# EAGLE design BalancingRobotFullSizePCB (EAGLE 6.6.0)
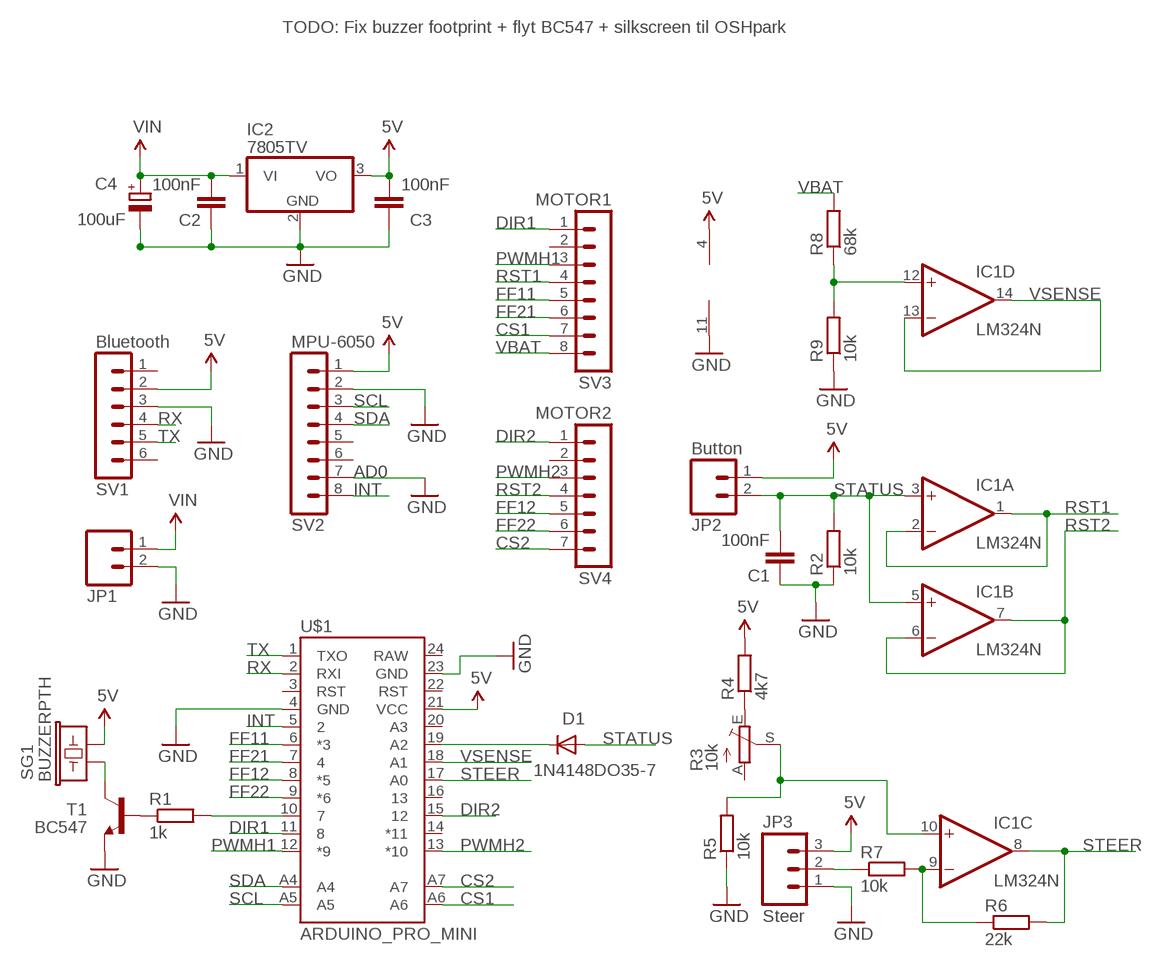
[diagram p0: schematic, sheet 1]

## Parts
C1  100nF  C-EU025-025X050  [C025-025X050]
C2  100nF  C-EU025-025X050  [C025-025X050]
C3  100nF  C-EU025-025X050  [C025-025X050]
C4  100uF  CPOL-EUE2.5-5  [E2,5-5]
D1  1N4148DO35-7  [DO35-7]
IC1  LM324N  [DIL14]
IC2  7805TV  [TO220V]
JP1  M02PTH  [1X02]
JP2  Button  M02PTH  [1X02]
JP3  Steer  M03PTH  [1X03]
R1  1k  R-EU_0207/10  [0207/10]
R2  10k  R-EU_0207/10  [0207/10]
R3  10k  TRIM_EU-B25P  [B25P]
R4  4k7  R-EU_0207/10  [0207/10]
R5  10k  R-EU_0207/10  [0207/10]
R6  22k  R-EU_0207/10  [0207/10]
R7  10k  R-EU_0207/10  [0207/10]
R8  68k  R-EU_0207/10  [0207/10]
R9  10k  R-EU_0207/10  [0207/10]
SG1  BUZZERPTH  [BUZZER-12MM]
SV1  Bluetooth  MA06-1  [MA06-1]
SV2  MPU-6050  MA08-1  [MA08-1]
SV3  MOTOR1  MA08-1  [MA08-1]
SV4  MOTOR2  MA07-1  [MA07-1]
T1  BC547  [TO92]
U$1  ARDUINO_PRO_MINI  [ARDUINO_PRO_MINI]

## Nets
5V: C3.2 IC1.4(P:V+) IC2.3(VO) JP2.1 JP3.3 R4.2 SG1.- SV1.2 SV2.1 U$1.21(VCC)
CS1: SV3.7 U$1.A6
CS2: SV4.7 U$1.A7
DIR1: SV3.1 U$1.11
DIR2: SV4.1 U$1.15
FF11: SV3.5 U$1.6(*3)
FF12: SV4.5 U$1.8(*5)
FF21: SV3.6 U$1.7
FF22: SV4.6 U$1.9(*6)
GND: C1.1 C2.1 C3.1 C4.- IC1.11(P:V-) IC2.2(GND) JP1.2 JP3.1 R2.1 R5.1 R9.1 SV1.3 SV2.2 SV2.7 T1.1(E) U$1.4(GND) U$1.23(GND)
INT: SV2.8 U$1.5
N$1: IC1.12(D:+IN) R8.1 R9.2
N$2: D1.C U$1.19(A2)
N$3: R1.1 T1.2(B)
N$4: SG1.+ T1.3(C)
N$5: R1.2 U$1.10
N$6: R3.E R4.1
N$7: IC1.10(C:+IN) R3.S R5.2
N$8: IC1.9(C:-IN) R6.1 R7.2
N$9: JP3.2 R7.1
PWMH1: SV3.3 U$1.12(*9)
PWMH2: SV4.3 U$1.13(*10)
RST1: IC1.1(A:OUT) IC1.2(A:-IN) SV3.4
RST2: IC1.6(B:-IN) IC1.7(B:OUT) SV4.4
RX: SV1.4 U$1.2(RXI)
SCL: SV2.3 U$1.A5
SDA: SV2.4 U$1.A4
STATUS: C1.2 D1.A IC1.3(A:+IN) IC1.5(B:+IN) JP2.2 R2.2
STEER: IC1.8(C:OUT) R6.2 U$1.17(A0)
TX: SV1.5 U$1.1(TXO)
VBAT: R8.2 SV3.8
VIN: C2.2 C4.+ IC2.1(VI) JP1.1
VSENSE: IC1.13(D:-IN) IC1.14(D:OUT) U$1.18(A1)
Unconnected: R3.A SV1.1 SV1.6 SV2.5 SV2.6 SV3.2 SV4.2 U$1.3(RST) U$1.14(*11) U$1.16 U$1.20(A3) U$1.22(RST) U$1.24(RAW)

## Notes on the sheet
- TODO: Fix buzzer footprint + flyt BC547 + silkscreen til OSHpark
- AD0

## Library data of the parts
C1-C3 = rcl:C-EU: CAPACITOR, European symbol
C4 = rcl:CPOL-EU: POLARIZED CAPACITOR, European symbol
D1 = diode:1N4148: DIODE high speed (Philips)
IC1 = linear:LM324: OP AMP
IC2 = linear:78*: Positive VOLTAGE REGULATOR Source: http://cache.national.com/ds/LM/LM78L05.pdf http://www.fairchildsemi.com/ds/LM/LM7805.pdf
JP1 JP2 = SparkFun-Connectors:M02: Standard 2-pin 0.1" header. Use with - straight break away headers ( PRT-00116) - right angle break away headers (PRT-00553) - swiss pins (PRT-00743) - machine pins (PRT-00117) - female headers (PRT-00115) Molex polarized connector foot print use with: PRT-08233 with associated crimp pins and housings. 2.54_SCREWTERM for use with PRT-10571. 3.5mm Screw Terminal footprints for PRT-08084 5mm Screw Terminal footprints for use with PRT-08433
JP3 = SparkFun-Connectors:M03: Header 3 Standard 3-pin 0.1" header. Use with straight break away headers (SKU : PRT-00116), right angle break away headers (PRT-00553), swiss pins (PRT-00743), machine pins (PRT-00117), and female headers (PRT-00115). Molex polarized connector foot print use with SKU : PRT-08232 with associated crimp pins and housings.
R1 R2 R4-R9 = rcl:R-EU_: RESISTOR, European symbol
R3 = pot:TRIM_EU-: POTENTIOMETER
SG1 = SparkFun-Electromechanical:BUZZER: Buzzer 12mm Spark Fun Electronics SKU : Comp-Buzzer
SV1 = con-lstb:MA06-1: PIN HEADER; OC_FARNELL: unknown; OC_NEWARK: unknown
SV2 SV3 = con-lstb:MA08-1: PIN HEADER; OC_FARNELL: unknown; OC_NEWARK: unknown
SV4 = con-lstb:MA07-1: PIN HEADER; OC_FARNELL: unknown; OC_NEWARK: unknown
T1 = transistor:BC547: NPN TRANSISTOR
U$1 = SparkFun-Boards:ARDUINO_PRO_MINI

## Board
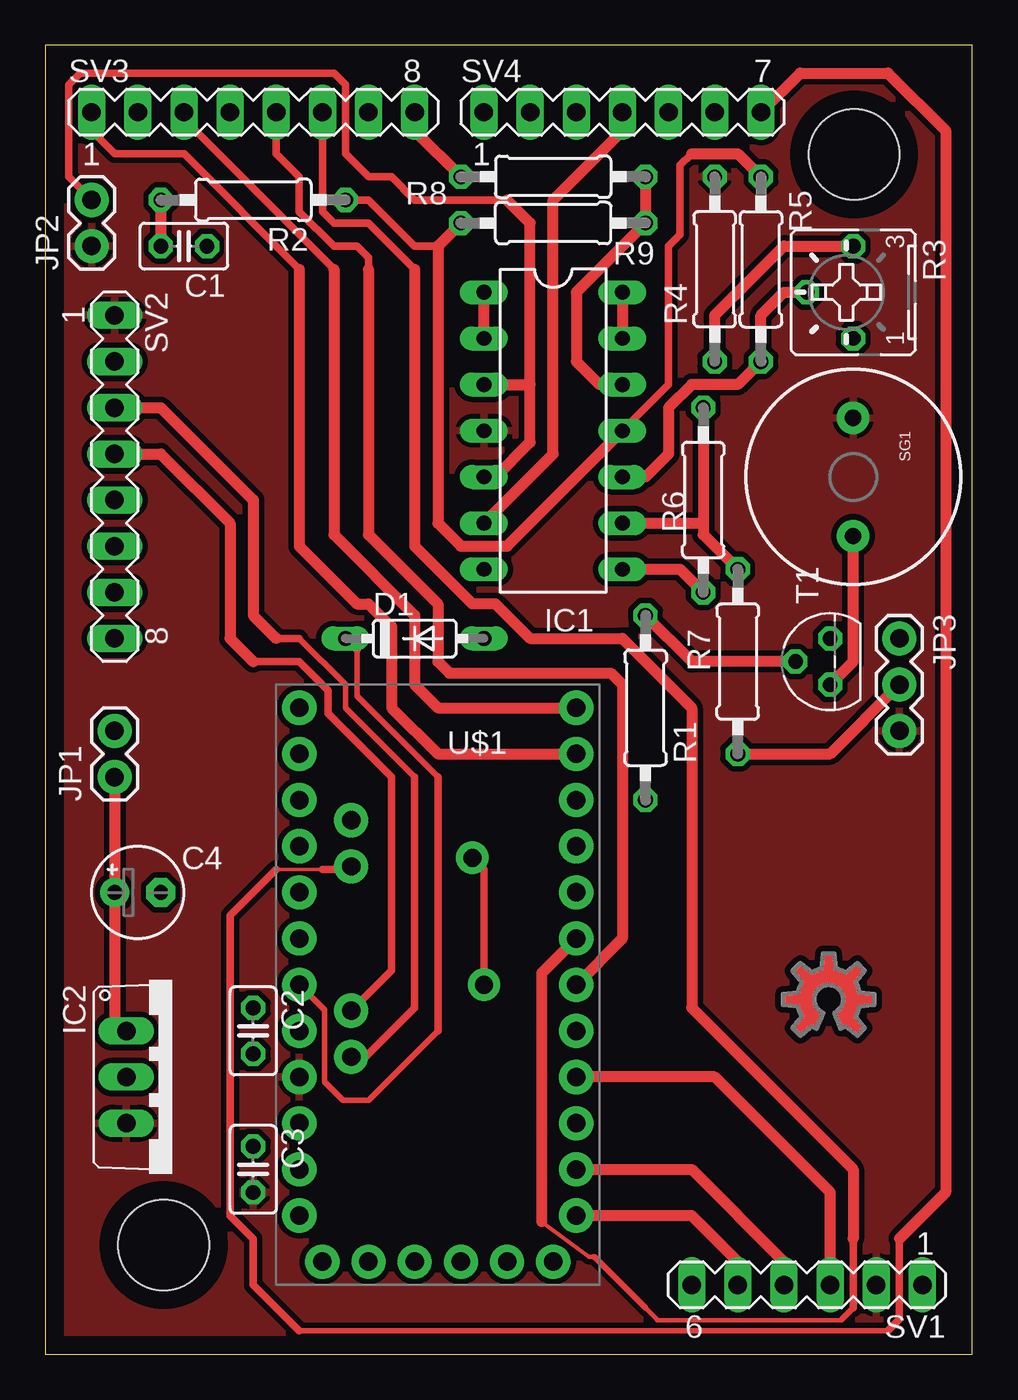
[diagram p1: board, top side]
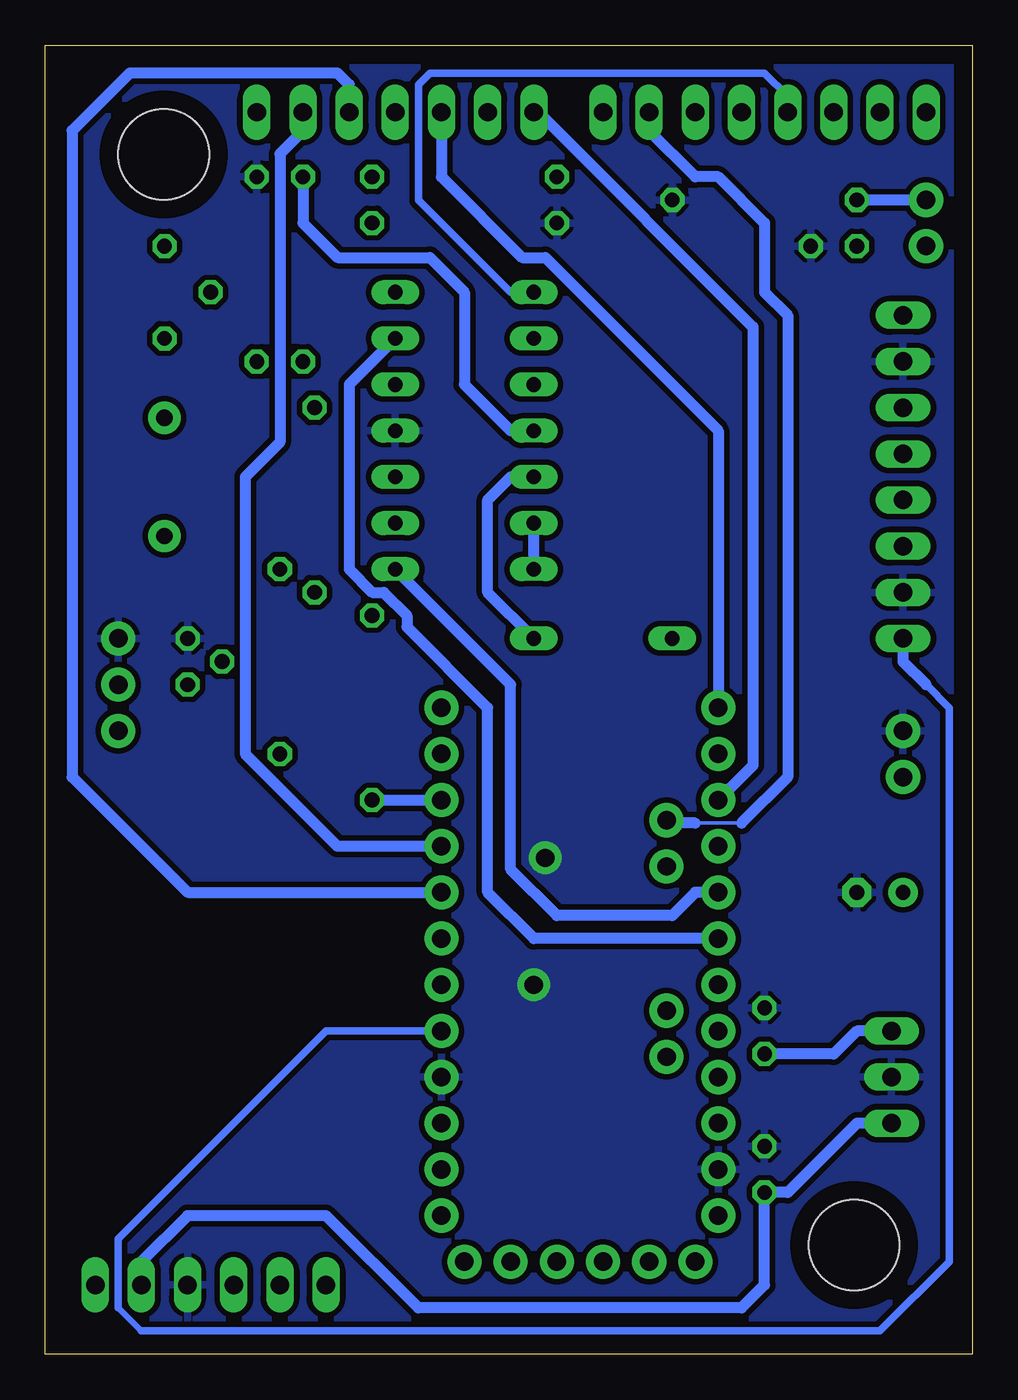
[diagram p2: board, bottom side, seen from below]

Size 51 x 72 mm. Coordinates in mm from the lower left corner, seen from the top.
Outline: 0,0 51,0 51,72 0,72 0,0
Copper layers (1*16): Top 0.035mm / dielectric 1.5mm / Bottom 0.035mm
Design rules "Design_rules": minimum track width 0.2mm, minimum drill 0.8mm, track to track 12mil, track to pad 12mil, pad to pad 12mil, via to via 12mil, smd to smd 12mil, copper to edge 40mil, drill to drill 8mil, minimum pad ring 10mil, minimum via ring 8mil, stop-mask expansion 4mil, vias tented up to drill 0mil, thermal gap 10mil
Holes 5 mm at 6.5,6 44.5,66

### Footprints (pad centres in the part's own frame; a part is rotated, then mirrored left to right if it is on the bottom)
C025-025X050 = drill 0.813 octagon: 1 -1.27,0; 2 1.27,0
E2,5-5 = drill 0.813 pad 1.6: + -1.27,0 | drill 0.813 pad 1.6 octagon: - 1.27,0
DO35-7 = drill 0.813 long: A 3.81,0; C -3.81,0
DIL14 = drill 0.813 long: 1 -7.62,-3.81; 2 -5.08,-3.81; 3 -2.54,-3.81; 4 0,-3.81; 5 2.54,-3.81; 6 5.08,-3.81; 7 7.62,-3.81; 8 7.62,3.81; 9 5.08,3.81; 10 2.54,3.81; 11 0,3.81; 12 -2.54,3.81; 13 -5.08,3.81; 14 -7.62,3.81
TO220V = drill 1.016 long: 1 -2.54,-2.54; 2 0,-2.54; 3 2.54,-2.54
1X02 = drill 1.016 pad 1.88: 1 0,0; 2 2.54,0
1X03 = drill 1.016 pad 1.88: 1 0,0; 2 2.54,0; 3 5.08,0
0207/10 = drill 0.813 octagon: 1 -5.08,0; 2 5.08,0
B25P = drill 0.813 octagon: A -2.54,0; E 2.54,0; S 0,2.54
BUZZER-12MM = drill 0.9 pad 1.778: + 3.25,0; - -3.25,0
MA06-1 = drill 1.016 long: 1 -6.35,0; 2 -3.81,0; 3 -1.27,0; 4 1.27,0; 5 3.81,0; 6 6.35,0
MA08-1 = drill 1.016 long: 1 -8.89,0; 2 -6.35,0; 3 -3.81,0; 4 -1.27,0; 5 1.27,0; 6 3.81,0; 7 6.35,0; 8 8.89,0
MA07-1 = drill 1.016 long: 1 -7.62,0; 2 -5.08,0; 3 -2.54,0; 4 0,0; 5 2.54,0; 6 5.08,0; 7 7.62,0
TO92 = drill 0.813 octagon: 1 1.27,0; 2 0,1.905; 3 -1.27,0
ARDUINO_PRO_MINI = drill 1.016 pad 1.88: 1 -7.62,12.7; 2 -7.62,10.16; 3 -7.62,7.62; 4 -7.62,5.08; 5 -7.62,2.54; 6 -7.62,0; 7 -7.62,-2.54; 8 -7.62,-5.08; 9 -7.62,-7.62; 10 -7.62,-10.16; 11 -7.62,-12.7; 12 -7.62,-15.24; 13 7.62,-15.24; 14 7.62,-12.7; 15 7.62,-10.16; 16 7.62,-7.62; 17 7.62,-5.08; 18 7.62,-2.54; 19 7.62,0; 20 7.62,2.54; 21 7.62,5.08; 22 7.62,7.62; 23 7.62,10.16; 24 7.62,12.7; A4 4.763,1.429; A5 4.763,3.969; A6 4.763,-9.049; A7 4.763,-6.509; BLK -6.35,15.24; GND -3.81,15.24; GRN 6.35,15.24; RXI 1.27,15.24; TXO 3.81,15.24; VCC -1.27,15.24

### Placement (x,y rotation side)
C1  7.62,60.96 180 top
C2  11.43,17.78 270 top
C3  11.43,10.16 270 top
C4  5.08,25.4 0 top
D1  20.32,39.37 0 top
IC1  27.94,50.8 270 top
IC2  6.99,15.24 270 top
JP1  3.81,31.75 90 top
JP2  2.54,60.96 90 top
JP3  46.99,39.37 270 top
R1  33.02,35.56 270 top
R2  11.43,63.5 180 top
R3  44.45,58.42 90 top
R4  36.83,59.69 90 top
R5  39.37,59.69 270 top
R6  36.2,46.99 270 top
R7  38.1,38.1 90 top
R8  27.94,64.77 180 top
R9  27.94,62.23 0 top
SG1  44.45,48.26 270 top
SV1  41.91,3.81 180 top
SV2  3.81,48.26 270 top
SV3  11.43,68.33 0 top
SV4  31.75,68.33 0 top
T1  43.18,38.1 90 top
U$1  21.59,20.32 180 top
U$4  [OSHWLOGO_TOP_0.2]  43.1,19.51 0 top

### Tracks (layer width: path | path; a pad name or v marks a point on that pad's centre or on a via)
5V
  Bottom 0.61: SV1.2 45.72,5.08 43.18,7.62 35.56,7.62 30.48,2.54 12.7,2.54 11.43,3.81 C3.2 10.16,8.89 6.35,12.7 IC2.3 | R4.2 36.83,62.23 34.92,60.33 29.84,60.33 27.94,58.42 27.94,53.34 25.4,50.8 IC1.4
  pour Top: -21.05,76.54 53,74 53,-2 -13.43,-2
CS1
  Bottom 0.203: 12.7,29.21 15.24,29.21
  Bottom 0.61: 15.24,29.21 16.67,29.21 U$1.A6 | SV3.7 17.78,67.31 15.24,64.77 13.97,64.77 11.43,62.23 11.43,58.42 10.16,57.15 10.16,31.75 12.7,29.21
CS2
  Top 0.203: 12.7,26.67 15.24,26.67
  Top 0.305: 46.35,1.27 13.97,1.27
  Top 0.406: 46.99,6.35 46.99,1.91 46.35,1.27 | 12.7,26.67 10.16,24.13 10.16,7.62 11.43,6.35 11.43,3.81 13.97,1.27 | 15.24,26.67 16.67,26.67 U$1.A7
  Top 0.61: SV4.7 41.53,70.48 46.35,70.48 49.53,67.31 49.53,8.89 46.99,6.35
DIR1
  Top 0.406: SV3.1 2.54,67.31 3.81,66.04 7.62,66.04 13.97,59.69
  Top 0.61: 13.97,59.69 13.97,44.45 17.14,41.27 17.78,41.27 19.05,40.01 19.05,35.56 21.59,33.02 U$1.11
DIR2
  Bottom 0.61: SV4.1 23.88,68.33 12.06,56.52 12.06,32.38 U$1.15
FF11
  Top 0.406: 17.78,59.69 17.78,60.33 17.14,60.96 15.88,60.96 13.97,62.87 13.97,64.77 12.7,66.04 SV3.5
  Top 0.61: 17.78,59.69 17.78,45.09 21.59,41.27 21.59,38.1 22.23,37.47 31.11,37.47 31.75,36.83 31.75,22.86 U$1.6
FF12
  Bottom 0.61: SV4.5 34.29,69.85 34.92,70.48 46.35,70.48 49.53,67.31 49.53,31.75 43.18,25.4 U$1.8
FF21
  Top 0.254: 43.81,1.91 43.81,1.85 34.29,1.85 33.71,1.85 | 27.3,7.29 29.92,5.36 30.15,5.36 | 33.71,1.85 33.66,1.85 | 33.02,2.54 33.71,1.85
  Top 0.305: 44.45,2.54 43.81,1.91 | 30.15,5.36 30.2,5.36 33.02,2.54
  Top 0.406: 44.45,6.35 44.45,2.54 | SV3.6 15.24,62.87 15.88,62.23 17.78,62.23 20.32,59.69
  Top 0.61: 20.32,59.69 20.32,44.45 23.5,41.27 24.77,41.27 26.67,39.37 31.75,39.37 35.56,35.56 35.56,19.05 44.45,10.16 44.45,6.35 | U$1.7 27.3,20.95 27.3,7.29
FF22
  Bottom 0.61: SV4.6 36.83,67.31 38.1,66.04 38.1,50.16 40.01,48.26 40.01,33.02 34.92,27.94 U$1.9
GND  (via drill 1 pad 1.78)
  Top 0.406: IC1.11 34.29,53.34 34.29,60.96 34.92,61.59 34.92,65.41 35.56,66.04 | R2.1 17.78,63.5 20.32,60.96 21.59,60.96 | v23.5,27.3 24.13,26.67 v24.13,20.32
  Top 0.61: 35.56,66.04 38.1,66.04 R5.1 | R9.1 21.59,60.96 21.59,45.72 22.86,44.45 25.4,44.45 IC1.11 | SV1.3 43.18,8.89 36.83,15.24 U$1.4
  pour Bottom: -26.13,76.54 53,74 53,-2 -15.97,-2
INT
  Bottom 0.305: 46.99,2.54 45.72,1.27
  Bottom 0.406: 2.54,36.83 1.27,35.56 1.27,5.08 5.08,1.27 45.72,1.27 | U$1.5 35.56,17.78 46.99,6.35 46.99,2.54
  Bottom 0.61: SV2.8 3.81,38.1 2.54,36.83
N$1
  Top 0.61: R8.1 R9.2 29.21,58.42 29.21,54.61 30.48,53.34 IC1.12
N$2
  Top 0.305: 17.14,38.73 17.14,36.2 21.59,31.75 | U$1.19 15.37,18.92 15.37,14.99 16.38,13.97 17.78,13.97 21.59,17.78
  Top 0.406: D1.C 17.14,38.73 | 21.59,31.75 21.59,17.78
N$3
  Top 0.61: T1.2 35.56,38.1 R1.1
N$4
  Top 0.61: T1.3 44.45,38.1 SG1.+
N$5
  Bottom 0.61: R1.2 U$1.10
N$6
  Top 0.61: R4.1 36.83,57.15 40.64,60.96 R3.E
N$7
  Top 0.61: R3.S 40.64,58.42 39.37,57.15 R5.2 38.1,53.34 35.56,53.34 34.29,52.07 34.29,49.53 33.02,48.26 IC1.10
N$8
  Top 0.61: R6.1 36.2,45.72 | 36.2,45.72 36.2,45.09 R7.2 | IC1.9 36.2,45.72
N$9
  Top 0.61: R7.1 43.18,33.02 JP3.2
PWMH1
  Top 0.406: SV3.3 7.62,67.94 15.88,59.69
  Top 0.61: 15.88,59.69 15.88,45.09 20.32,40.64 20.32,36.83 21.59,35.56 U$1.12
PWMH2
  Bottom 0.61: SV4.3 29.21,64.77 24.77,60.33 23.5,60.33 13.97,50.8 U$1.13
RST1
  Top 0.61: IC1.2 IC1.1
  Bottom 0.406: SV3.4 10.16,69.22 11.43,70.48 29.84,70.48 30.48,69.85 30.48,63.5 25.4,58.42 IC1.1
RST2
  Top 0.61: IC1.6 27.94,49.53 27.94,63.5 31.75,67.31 SV4.4
  Bottom 0.61: IC1.7 IC1.6
RX
  Top 0.61: U$1.2 35.56,10.16 40.64,5.08 SV1.4
SCL
  Top 0.305: 20.32,31.75 16.51,35.56 16.51,36.83 13.97,39.37
  Top 0.406: 20.32,31.75 20.32,19.05 17.62,16.35 U$1.A5 | 13.97,39.37 12.7,39.37
  Top 0.61: SV2.3 6.35,52.07 11.43,46.99 11.43,40.64 12.7,39.37
SDA
  Top 0.406: U$1.A4 19.05,21.11 19.05,31.75 15.56,35.24 15.56,36.51 13.97,38.1 11.43,38.1
  Top 0.61: SV2.4 6.35,49.53 10.16,45.72 10.16,39.37 11.43,38.1
STATUS
  Top 0.406: JP2.2 1.27,64.77 1.27,69.85 1.91,70.48 15.88,70.48 16.51,69.85 16.51,66.04 17.78,64.77 19.05,64.77 20.32,63.5 25.4,63.5
  Top 0.61: R2.2 C1.2 | IC1.5 24.77,48.26 26.67,50.16 26.67,53.34 | IC1.3 26.67,53.34 | 26.67,53.34 26.67,62.23 25.4,63.5
  Bottom 0.61: D1.A 26.67,41.91 26.67,46.99 25.4,48.26 IC1.5 | JP2.2 R2.2
STEER
  Top 0.61: IC1.8 34.92,43.18 R6.2
  Bottom 0.61: U$1.17 15.24,25.4 16.51,24.13 22.86,24.13 25.4,26.67 25.4,36.83 IC1.8
TX
  Top 0.61: SV1.5 38.1,5.08 35.56,7.62 U$1.1
VBAT
  Top 0.61: SV3.8 20.32,67.31 R8.2
VIN
  Top 0.61: JP1.1 C4.+ 3.81,18.41 IC2.1
  Bottom 0.61: IC2.1 6.35,17.78 7.62,16.51 C2.2
VSENSE
  Top 0.61: IC1.14 IC1.13
  Bottom 0.61: U$1.18 24.13,22.86 26.67,25.4 26.67,35.56 31.11,40.01 31.11,40.64 32.38,41.91 33.02,41.91 34.29,43.18 34.29,53.34 IC1.13